# EAGLE design PIC32MX250F128B (EAGLE 5.12)
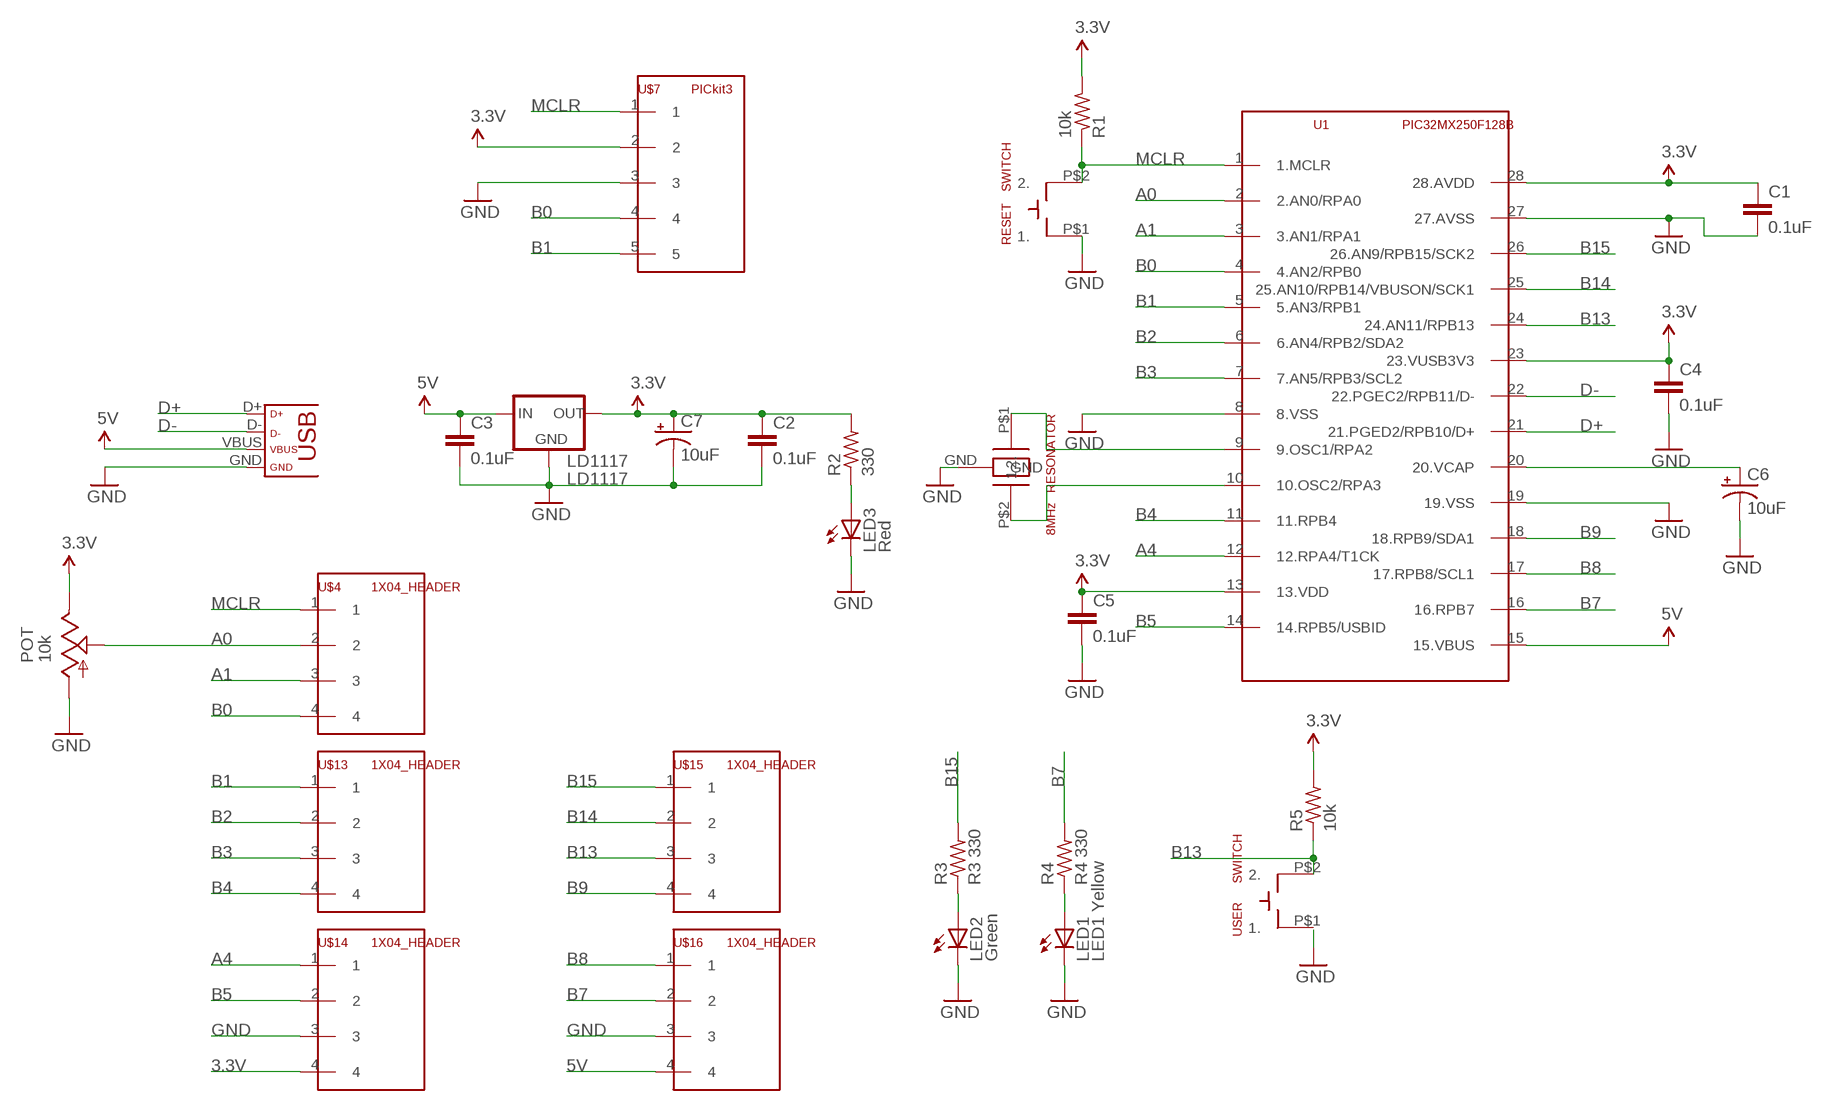
[diagram p0: schematic, sheet 1]

## Parts
C1  0.1uF  C2.5/2  [C2.5-2]
C2  0.1uF  C2.5/2  [C2.5-2]
C3  0.1uF  C2.5/2  [C2.5-2]
C4  0.1uF  C2.5/2  [C2.5-2]
C5  0.1uF  C2.5/2  [C2.5-2]
C6  10uF  CAP_POL  [CAP_POL_D]
C7  10uF  CAP_POL  [CAP_POL_D]
LD1117  LD1117  [TO220]
LED1  LED1 Yellow  LED3MM  [LED3MM]
LED2  Green  LED3MM  [LED3MM]
LED3  Red  LED3MM  [LED3MM]
POT  10k  POT  [POT]
R1  10k  R-US_0207/7  [0207/7]
R2  330  R-US_0204/7  [0204/7]
R3  R3 330  R-US_0204/7  [0204/7]
R4  R4 330  R-US_0204/7  [0204/7]
R5  10k  R-US_0204/7  [0204/7]
RESET  SWITCH  [SWITCH]
RESONATOR  8MHz  8MHZCRYSTALRESONATOR  [8MHZCRYSTALRESONATOR]
U1  PIC32MX250F128B  [DIL28-3]
U$4  1X04_HEADER  [1X04]
U$7  PICkit3  1X05_HEADER  [1X05]
U$13  1X04_HEADER  [1X04]
U$14  1X04_HEADER  [1X04]
U$15  1X04_HEADER  [1X04]
U$16  1X04_HEADER  [1X04]
USB  USB  [USB-MINIB]
USER  SWITCH  [SWITCH]

## Nets
3.3V: C2.1 C4.1 C5.1 C7.1(+) LD1117.2(OUT) POT.P$1(1.) R1.2 R2.2 R5.2 U1.13(13.VDD) U1.23(23.VUSB3V3) U$14.4
5V: C3.1 LD1117.3(IN) U1.15(15.VBUS) U$16.4
A0: POT.P$2(2.) U1.2(2.AN0/RPA0) U$4.2
A1: U1.3(3.AN1/RPA1) U$4.3
A4: U1.12(12.RPA4/T1CK) U$14.1
B0: U1.4(4.AN2/RPB0) U$4.4 U$7.4
B1: U1.5(5.AN3/RPB1) U$7.5 U$13.1
B2: U1.6(6.AN4/RPB2/SDA2) U$13.2
B3: U1.7(7.AN5/RPB3/SCL2) U$13.3
B4: U1.11(11.RPB4) U$13.4
B5: U1.14(14.RPB5/USBID) U$14.2
B7: R4.2 U1.16(16.RPB7) U$16.2
B8: U1.17(17.RPB8/SCL1) U$16.1
B9: U1.18(18.RPB9/SDA1) U$15.4
B13: R5.1 U1.24(24.AN11/RPB13) U$15.3 USER.P$2(2.)
B14: U1.25(25.AN10/RPB14/VBUSON/SCK1) U$15.2
B15: R3.2 U1.26(26.AN9/RPB15/SCK2) U$15.1
D+: U1.21(21.PGED2/RPB10/D+) USB.D+
D-: U1.22(22.PGEC2/RPB11/D-) USB.D-
GND: C2.2 C3.2 C4.2 C5.2 C6.2(-) C7.2(-) LD1117.1(GND) LED1.K(C) LED2.K(C) LED3.K(C) POT.P$3(3.) RESET.P$1(1.) RESONATOR.GND U1.8(8.VSS) U1.19(19.VSS) U$14.3 U$16.3
MCLR: R1.1 RESET.P$2(2.) U1.1(1.MCLR) U$4.1 U$7.1
N$1: LED3.A R2.1
N$3: RESONATOR.P$1(1.) U1.9(9.OSC1/RPA2)
N$4: LED2.A R3.1
N$5: LED1.A R4.1
N$6: USB.VBUS ; supply symbol labelled 5V
N$7: USB.GND ; supply symbol labelled GND
N$10: RESONATOR.P$2(2.) U1.10(10.OSC2/RPA3)
N$14: C1.1 U1.28(28.AVDD) ; supply symbol labelled 3.3V
N$16: C1.2 ; supply symbol labelled GND
N$23: C6.1(+) U1.20(20.VCAP)
N$28: U$7.2 ; supply symbol labelled 3.3V
N$29: U$7.3 ; supply symbol labelled GND
Unconnected: U1.27(27.AVSS) USER.P$1(1.)

## Library data of the parts
C1-C5 = ME433:C: CAPACITOR naming: grid - package width
C6 C7 = ME433:CAP_POL
LD1117 = ME433:LD1117
LED1-LED3 = ME433:LED: LED OSRAM: - CHIPLED LG R971, LG N971, LY N971, LG Q971, LY Q971, LO R971, LY R971 LH N974, LH R974 LS Q976, LO Q976, LY Q976 LO Q996 - Hyper CHIPLED LW Q18S LB Q993, LB Q99A, LB R99A - SideLED LS A670, LO A670, LY A670, LG A670, LP A670 LB A673, LV A673, LT A673, LW A673 LH A674 LY A675 LS A676, LA A676, LO A676, LY A676, LW A676 LS A679, LY A679, LG A679 - Hyper Micro SIDELED® LS Y876, LA Y876, LO Y876, LY Y876 LT Y87S - SmartLED LW L88C, LW L88S LB L89C, LB L89S, LG L890 LS L89K, LO L89K, LY L89K LS L896, LA L896, LO L896, LY L896 - TOPLED LS T670, LO T670, LY T670, LG T670, LP T670 LSG T670, LSP T670, LSY T670, LOP T670, LYG T670 LG T671, LOG T671, LSG T671 LB T673, LV T673, LT T673, LW T673 LH T674 LS T676, LA T676, LO T676, LY T676, LB T676, LH T676, LSB T676, LW T676 LB T67C, LV T67C, LT T67C, LS T67K, LO T67K, LY T67K, LW E67C LS E67B, LA E67B, LO E67B, LY E67B, LB E67C, LV E67C, LT E67C LW T67C LS T679, LY T679, LG T679 LS T770, LO T770, LY T770, LG T770, LP T770 LB T773, LV T773, LT T773, LW T773 LH T774 LS E675, LA E675, LY E675, LS T675 LS T776, LA T776, LO T776, LY T776, LB T776 LHGB T686 LT T68C, LB T68C - Hyper Mini TOPLED® LB M676 - Mini TOPLED Santana® LG M470 LS M47K, LO M47K, LY M47K Source: http://www.osram.convergy.de LUXEON: - LUMILED® LXK2-PW12-R00, LXK2-PW12-S00, LXK2-PW14-U00, LXK2-PW14-V00 LXK2-PM12-R00, LXK2-PM12-S00, LXK2-PM14-U00 LXK2-PE12-Q00, LXK2-PE12-R00, LXK2-PE12-S00, LXK2-PE14-T00, LXK2-PE14-U00 LXK2-PB12-K00, LXK2-PB12-L00, LXK2-PB12-M00, LXK2-PB14-N00, LXK2-PB14-P00, LXK2-PB14-Q00 LXK2-PR12-L00, LXK2-PR12-M00, LXK2-PR14-Q00, LXK2-PR14-R00 LXK2-PD12-Q00, LXK2-PD12-R00, LXK2-PD12-S00 LXK2-PH12-R00, LXK2-PH12-S00 LXK2-PL12-P00, LXK2-PL12-Q00, LXK2-PL12-R00 Source: www.luxeon.com KINGBRIGHT: KA-3528ASYC Source: www.kingbright.com
POT = ME433:POT
R1-R5 = ME433:R-US_: RESISTOR, American symbol
RESET USER = ME433:SWITCH
RESONATOR = ME433:8MHZCRYSTALRESONATOR
U1 = ME433:PIC32MX250F128B
U$4 U$13-U$16 = ME433:1X04_HEADER
U$7 = ME433:1X05_HEADER
USB = ME433:USB

## Board
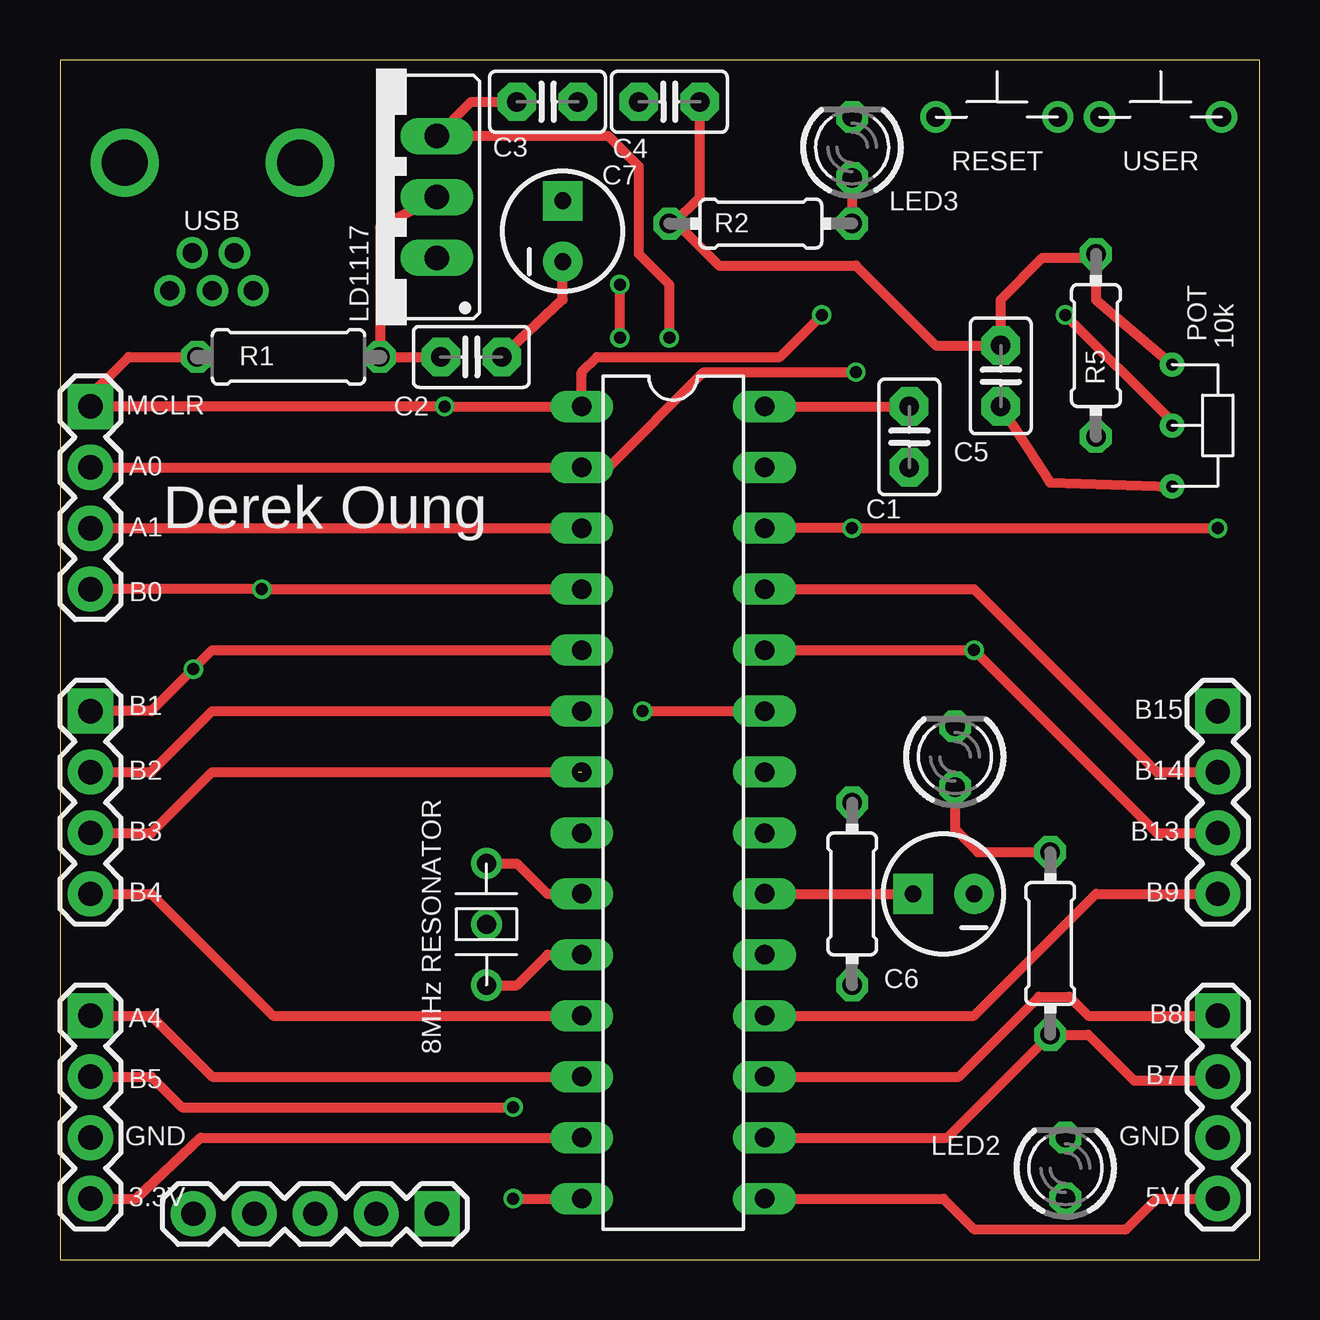
[diagram p1: board, top side]
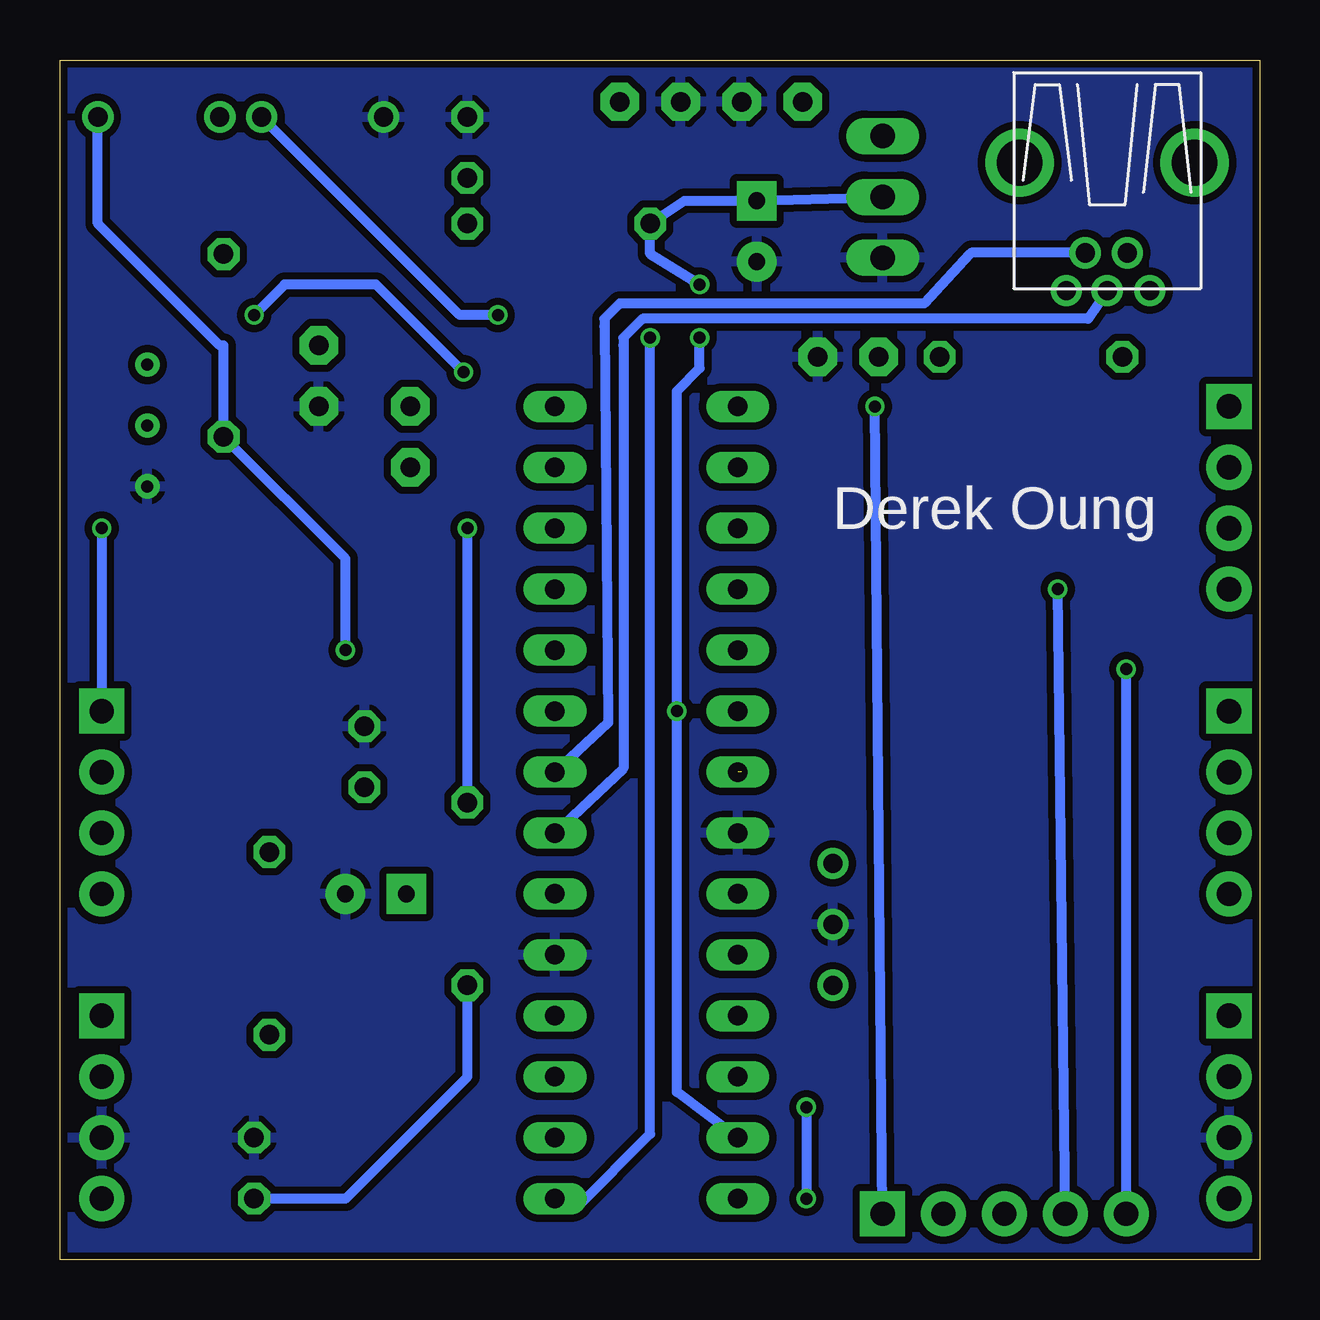
[diagram p2: board, bottom side, seen from below]

Size 50 x 50 mm. Coordinates in mm from the lower left corner, seen from the top.
Outline: 0,0 50,0 50,50 0,50 0,0
Copper layers (1*16): Top 0.035mm / dielectric 1.5mm / Bottom 0.035mm
Design rules "SeeedStudio_2layer_DRU_no_angle_20140221": minimum track width 6mil, minimum drill 12mil, track to track 6mil, track to pad 6mil, pad to pad 6mil, via to via 6mil, smd to smd 0mil, copper to edge 10mil, drill to drill 10mil, minimum pad ring 10mil, minimum via ring 6mil, stop-mask expansion 2mil, vias tented up to drill 100mil, thermal gap 10mil

### Footprints (pad centres in the part's own frame; a part is rotated, then mirrored left to right if it is on the bottom)
C2.5-2 = drill 0.813 pad 1.6 octagon: 1 -1.27,0; 2 1.27,0
CAP_POL_D = drill 0.7 pad 1.651 square: 1 1.27,0 | drill 0.7 pad 1.651 round: 2 -1.27,0
TO220 = drill 1.016 long: 1 -2.54,0; 2 0,0; 3 2.54,0
LED3MM = drill 0.813 octagon: A -1.27,0; K 1.27,0
POT = drill 0.5 round: P$1 -2.54,0; P$2 0,0; P$3 2.54,0
0207/7 = drill 0.813 octagon: 1 -3.81,0; 2 3.81,0
0204/7 = drill 0.813 octagon: 1 -3.81,0; 2 3.81,0
SWITCH = drill 0.8 round: P$1 -2.54,0; P$2 2.54,0
8MHZCRYSTALRESONATOR = drill 0.8 round: GND 0,0; P$1 -2.54,0; P$2 2.54,0
DIL28-3 = drill 0.813 long: 1 -16.51,-3.81; 2 -13.97,-3.81; 3 -11.43,-3.81; 4 -8.89,-3.81; 5 -6.35,-3.81; 6 -3.81,-3.81; 7 -1.27,-3.81; 8 1.27,-3.81; 9 3.81,-3.81; 10 6.35,-3.81; 11 8.89,-3.81; 12 11.43,-3.81; 13 13.97,-3.81; 14 16.51,-3.81; 15 16.51,3.81; 16 13.97,3.81; 17 11.43,3.81; 18 8.89,3.81; 19 6.35,3.81; 20 3.81,3.81; 21 1.27,3.81; 22 -1.27,3.81; 23 -3.81,3.81; 24 -6.35,3.81; 25 -8.89,3.81; 26 -11.43,3.81; 27 -13.97,3.81; 28 -16.51,3.81
1X04 = drill 1.016 pad 1.88 square: 1 0,0 | drill 1.016 pad 1.88 round: 2 2.54,0; 3 5.08,0; 4 7.62,0
1X05 = drill 1.016 pad 1.88 square: 1 0,0 | drill 1.016 pad 1.88 round: 2 2.54,0; 3 5.08,0; 4 7.62,0; 5 10.16,0
USB-MINIB = drill 0.8 round: D+ 4.064,0; D- 2.489,0.914; GND 4.064,-1.778; ID 2.489,-0.838; VBUS 4.064,1.702 | drill 1.9 round: P$6 -1.27,-3.65; P$7 -1.27,3.65

### Placement (x,y rotation side)
C1  35.4,34.29 270 top
C2  17.14,37.62 0 top
C3  20.32,48.26 0 top
C4  25.4,48.26 180 top
C5  39.21,36.83 270 top
C6  36.83,15.24 180 top
C7  20.96,42.86 90 top
LD1117  15.72,44.29 90 top
LED1  37.31,20.95 90 top
LED2  41.91,3.81 90 top
LED3  33.02,46.35 90 top
POT  46.35,34.77 270 top
R1  9.53,37.62 0 top
R2  29.21,43.18 180 top
R3  33.02,15.24 90 top
R4  41.27,13.18 270 top
R5  43.18,38.1 90 top
RESET  39.05,47.62 0 top
RESONATOR  17.78,13.97 270 top
U1  25.56,19.05 270 top
U$4  1.27,35.56 270 top
U$7  15.72,1.9 180 top
U$13  1.27,22.86 270 top
U$14  1.27,10.16 270 top
U$15  48.26,22.86 270 top
U$16  48.26,10.16 270 top
USB  6.35,44.45 270 top
USER  45.88,47.62 0 top

### Tracks (layer width: path | path; a pad name or v marks a point on that pad's centre or on a via)
3.3V  (via drill 0.5)
  Top 0.406: U$14.4 3.17,2.54 5.87,5.08 U1.13 | C5.1 39.37,38.1 | C4.1 26.67,44.29 25.56,43.18 R2.2 25.72,43.18 27.46,41.43 33.18,41.43 36.51,38.1 C5.1 | POT.P$1 43.18,40.01 R5.2 43.02,41.75 40.96,41.75 39.21,40.01 C5.1 | C2.1 R1.2 13.34,43.02 LD1117.2 | v24.29,22.86 U1.23 | v23.34,38.42 v23.34,40.64
  Bottom 0.406: LD1117.2 C7.1 23.97,44.13 R2.2 25.4,41.91 v23.34,40.64 | U1.13 24.29,6.99 v24.29,22.86 24.29,36.2 23.34,37.15 v23.34,38.42
5V  (via drill 0.5)
  Top 0.406: U1.15 36.83,2.54 38.1,1.27 44.45,1.27 45.72,2.54 U$16.4 | C3.1 17.14,48.26 LD1117.3 22.86,46.83 24.13,45.56 24.13,41.91 25.4,40.64 v25.4,38.42
  Bottom 0.406: v25.4,38.42 25.4,5.24 28.42,2.22 28.57,2.22 28.89,2.54 U1.15
A0  (via drill 0.5)
  Top 0.406: U$4.2 U1.2 22.86,33.02 26.83,36.99 v33.18,36.99 | POT.P$2 46.25,35.03 v41.91,39.37
  Bottom 0.406: v41.91,39.37 40.64,40.64 36.83,40.64 v33.18,36.99
A1
  Top 0.406: U$4.3 U1.3
A4
  Top 0.406: U$14.1 3.81,10.16 6.35,7.62 U1.12
B0  (via drill 0.5)
  Top 0.406: U1.4 v8.41,27.94 U$4.4
  Bottom 0.406: U$7.4 v8.41,27.94
B1  (via drill 0.5)
  Top 0.406: U$13.1 3.81,22.86 v5.56,24.61 6.35,25.4 U1.5
  Bottom 0.406: U$7.5 v5.56,24.61
B2
  Top 0.406: U$13.2 3.81,20.32 6.35,22.86 U1.6
B3  (1 unrouted)
  Top 0.406: U$13.3 3.81,17.78 6.35,20.32 21.59,20.32
B4
  Top 0.406: U$13.4 3.81,15.24 8.89,10.16 U1.11
B5  (via drill 0.5)
  Top 0.406: U$14.2 3.81,7.62 5.08,6.35 v18.89,6.35 | v18.89,2.54 U1.14
  Bottom 0.406: v18.89,6.35 v18.89,2.54
B7
  Top 0.406: U1.16 36.99,5.08 R4.2 42.86,9.37 44.77,7.46 48.1,7.46 U$16.2
B8
  Top 0.406: U1.17 37.47,7.62 40.8,10.95 42.07,10.95 42.86,10.16 U$16.1
B9
  Top 0.406: U1.18 38.1,10.16 43.18,15.24 U$15.4
B13  (via drill 0.5)
  Top 0.406: U$15.3 45.72,17.78 v38.1,25.4 U1.24
  Bottom 0.406: v38.1,25.4 38.1,29.21 R5.1 43.18,38.1 43.34,38.1 48.42,43.18 USER.P$2
B14
  Top 0.406: U1.25 38.1,27.94 45.72,20.32 U$15.2
B15  (via drill 0.5)
  Top 0.406: v48.26,30.48 v33.02,30.48 U1.26
  Bottom 0.406: v48.26,30.48 U$15.1 | R3.2 v33.02,30.48
D+
  Bottom 0.406: USB.D+ 7.14,39.21 25.72,39.21 26.51,38.42 26.51,38.1 26.51,20.48 U1.21
D-
  Bottom 0.406: USB.D- 12.01,41.96 12.06,41.91 | 12.06,41.91 | 12.06,41.91 13.97,39.85 26.67,39.85 | 26.67,39.85 | U1.22 27.15,22.38 27.3,38.89 27.3,39.21 26.67,39.85
GND
  Top 0.406: C5.2 41.27,32.38 POT.P$3 | C2.2 20.95,40.01 C7.2
  pour Bottom (isolate 0.305): 0.16,50.01 0,50.01 0,-0.32 49.85,-0.32 49.85,0 49.85,49.69 50.01,49.85 0.32,49.85
MCLR  (via drill 0.5)
  Top 0.406: R1.1 2.86,37.62 1.27,36.04 U$4.1 v16.03,35.56 U1.1 21.75,36.83 | R1.1 | 21.75,36.83 | v31.75,39.37 30,37.62 22.38,37.62 21.75,36.99 21.75,36.83
  Bottom 0.406: U$7.1 v16.03,35.56 | v31.75,39.37 33.34,39.37 RESET.P$2
N$1
  Top 0.406: LED3.A | LED3.A R2.1
N$3
  Top 0.406: RESONATOR.P$1 19.05,16.51 20.32,15.24 U1.9
N$4
  Bottom 0.406: R3.1 33.02,7.62 38.1,2.54 LED2.A
N$5
  Top 0.406: LED1.A 37.31,17.94 38.26,16.99 R4.1
N$10
  Top 0.406: RESONATOR.P$2 19.05,11.43 20.32,12.7 U1.10
N$14
  Top 0.406: U1.28 C1.1
N$23
  Top 0.406: U1.20 C6.1

### Text on the board
tPlace: MCLR | A0 | A1 | Derek Oung | B0 | B1 | B15 | B2 | B14 | B3 | B13 | B4 | B9 | A4 | B8 | 8MHz RESONATOR | B5 | B7 | GND | GND | 3.3V | 5V
bPlace: Derek Oung